# Altium schematic sheet Alimentation main board.SchDoc
size 508 x 193 mm
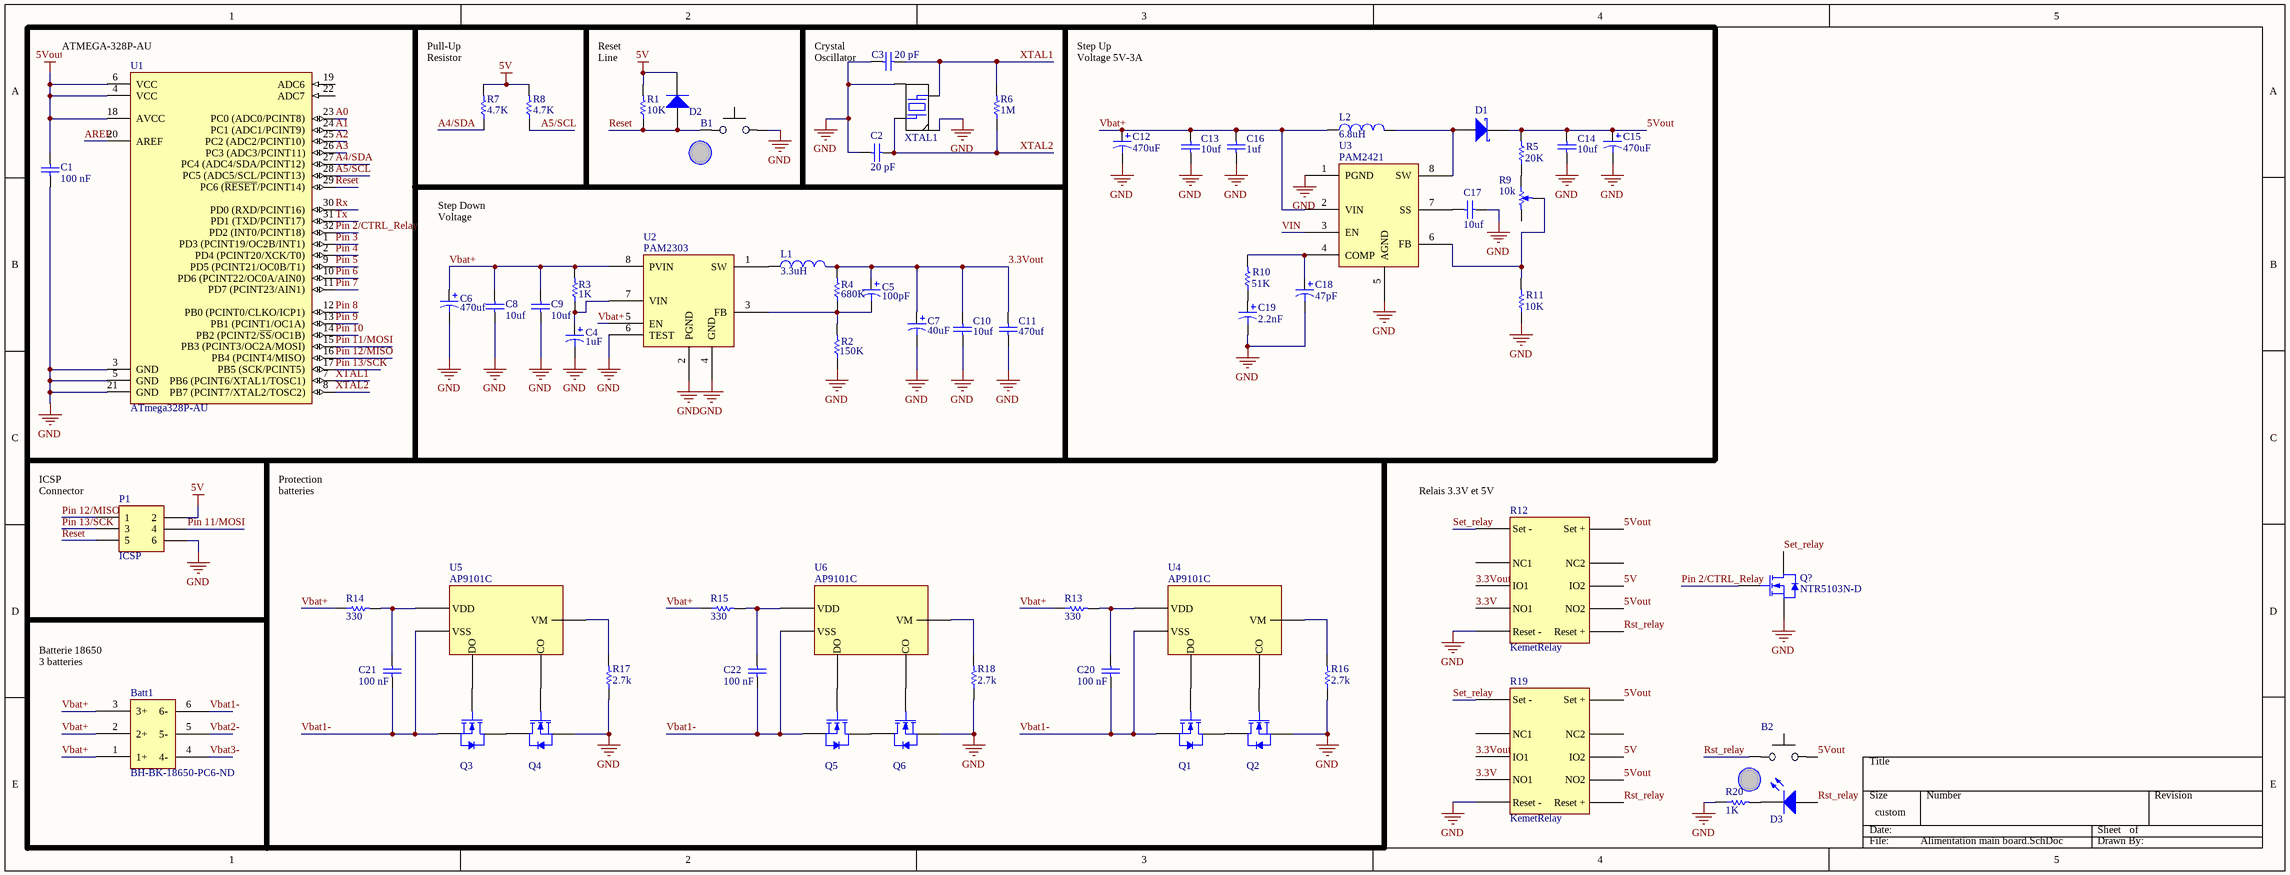
[diagram p0: Alimentation main board.SchDoc]

## Parts
B1  Button smd  [Button smd]  (value not drawn)
B2  Button smd  [Button smd]  (value not drawn)
Batt1  BH-BK-18650-PC6-ND  [BH-BK-18650-PC6-ND]
C1  100 nF  [CAP 0805 - N]
C2  20 pF  [CAP 0805 - N]
C3  20 pF  [CAP 0805 - N]
C4  value 1uF  [Capacitor 1 uF]  (hidden comment: Cap Pol1)
C5  value 100pF  [CAP 0805 - N]  (hidden comment: Cap Pol1)
C6  value 470uf  [Capacitor 40uF]  (hidden comment: Cap Pol1)
C7  value 40uF  [Capacitor 40uF]  (hidden comment: Cap Pol1)
C8  10uf  [CAP 0805 - N]
C9  10uf  [CAP 0805 - N]
C10  10uf  [CAP 0805 - N]
C11  470uf  [CAP 0805 - N]
C12  value 470uF  [Capacitor 470 uF]  (hidden comment: Cap Pol1)
C13  10uf  [CAP 0805 - N]
C14  10uf  [CAP 0805 - N]
C15  value 470uF  [Capacitor 470 uF]  (hidden comment: Cap Pol1)
C16  1uf  [CAP 0805 - N]
C17  10uf  [CAP 0805 - N]
C18  value 47pF  [CAP 0805 - N]  (hidden comment: Cap Pol1)
C19  value 2.2nF  [CAP 0805 - N]  (hidden comment: Cap Pol1)
C20  100 nF  [CAP 0805 - N]
C21  100 nF  [CAP 0805 - N]
C22  100 nF  [CAP 0805 - N]
D1  Diode SS34  [Diode]  (value not drawn)
D2  Diode 1N4148 SMD  [SOD-80]  (value not drawn)
D3  LED 1206  [LED - 1206]  (value not drawn)
L1  value 3.3uH  [Inductance]  (hidden comment: Inductor)
L2  value 6.8uH  [Inductance 6.8uH]  (hidden comment: Inductor)
P1  ICSP  [HDR2X3]
Q1  Mosfet 14A smd  [SON127P630X110-8N]  (value not drawn)
Q2  Mosfet 14A smd  [SON127P630X110-8N]  (value not drawn)
Q3  Mosfet 14A smd  [SON127P630X110-8N]  (value not drawn)
Q4  Mosfet 14A smd  [SON127P630X110-8N]  (value not drawn)
Q5  Mosfet 14A smd  [SON127P630X110-8N]  (value not drawn)
Q6  Mosfet 14A smd  [SON127P630X110-8N]  (value not drawn)
Q?  NTR5103N-D  [SOT-23-3-318-08_V]
R1  value 10K  [Res 0805 - N]  (hidden comment: Res smd)
R2  value 150K  [Res 0805 - N]  (hidden comment: Res1)
R3  value 1K  [Res 0805 - N]  (hidden comment: Res1)
R4  value 680K  [Res 0805 - N]  (hidden comment: Res1)
R5  value 20K  [Res 0805 - N]  (hidden comment: Res1)
R6  value 1M  [Res 0805 - N]  (hidden comment: Res smd)
R7  value 4.7K  [Res 0805 - N]  (hidden comment: Res smd)
R8  value 4.7K  [Res 0805 - N]  (hidden comment: Res smd)
R9  10k  [POT4MM-2]
R10  value 51K  [Res 0805 - N]  (hidden comment: Res1)
R11  value 10K  [Res 0805 - N]  (hidden comment: Res1)
R12  KemetRelay  [KemetRelay]
R13  value 330  [Res 0805 - N]  (hidden comment: Res smd)
R14  value 330  [Res 0805 - N]  (hidden comment: Res smd)
R15  value 330  [Res 0805 - N]  (hidden comment: Res smd)
R16  value 2.7k  [Res 0805 - N]  (hidden comment: Res smd)
R17  value 2.7k  [Res 0805 - N]  (hidden comment: Res smd)
R18  value 2.7k  [Res 0805 - N]  (hidden comment: Res smd)
R19  KemetRelay  [KemetRelay]
R20  value 1K  [Res 0805 - N]  (hidden comment: Res smd)
U1  ATmega328P-AU  [32A_N]
U2  Name: PAM2303  [SOP8]  (hidden comment: PAM2320)
U3  PAM2421  [SOP8]
U4  AP9101C  [SOT26]
U5  AP9101C  [SOT26]
U6  AP9101C  [SOT26]
XTAL1  Crystal oscillator 4 pin  [FA-238]  (value not drawn)

## Nets
5V: D2.2 P1.2 R1.2 R7.2 R8.2 R12.4(IO2) R19.4(IO2)
5Vout: B2.2 C1.2 C14.2 C15.1 D1.1(K) R5.2 R12.1(Set_+) R12.5(NO2) R19.1(Set_+) R19.5(NO2) U1.4(VCC) U1.6(VCC) U1.18(AVCC)
GND: B1.2 C1.1 C2.1 C3.1 C4.2 C6.2 C7.2 C8.1 C9.1 C10.1 C11.1 C12.2 C13.1 C14.1 C15.2 C16.1 C17.1 C18.2 C19.2 P1.6 Q2.S Q4.S Q6.S Q?.2(S) R2.1 R11.1 R12.7(Reset_-) R16.1 R17.1 R18.1 R19.7(Reset_-) R20.1 U1.3(GND) U1.5(GND) U1.21(GND) U2.2(PGND) U2.4(GND) U2.6(TEST) U3.1(PGND) U3.5(AGND) XTAL1.2 XTAL1.4
3.3V: R12.8(NO1) R19.8(NO1)
3.3Vout: C5.1 C7.1 C10.2 C11.2 L1.2 R4.2 R12.9(IO1) R19.9(IO1)
A0: U1.23(PC0_(ADC0/PCINT8))
A1: U1.24(PC1_(ADC1/PCINT9))
A2: U1.25(PC2_(ADC2/PCINT10))
A3: U1.26(PC3_(ADC3/PCINT11))
A4/SDA: R7.1 U1.27(PC4_(ADC4/SDA/PCINT12))
A5/SCL: R8.1 U1.28(PC5_(ADC5/SCL/PCINT13))
AREF: U1.20(AREF)
Pin 2/CTRL_Relay: Q?.1(G) U1.32(PD2_(INT0/PCINT18))
Pin 3: U1.1(PD3_(PCINT19/OC2B/INT1))
Pin 4: U1.2(PD4_(PCINT20/XCK/T0))
Pin 5: U1.9(PD5_(PCINT21/OC0B/T1))
Pin 6: U1.10(PD6_(PCINT22/OC0A/AIN0))
Pin 7: U1.11(PD7_(PCINT23/AIN1))
Pin 8: U1.12(PB0_(PCINT0/CLKO/ICP1))
Pin 9: U1.13(PB1_(PCINT1/OC1A))
Pin 10: U1.14(PB2_(PCINT2/~{SS}/OC1B))
Pin 11/MOSI: P1.4 U1.15(PB3_(PCINT3/OC2A/MOSI))
Pin 12/MISO: P1.1 U1.16(PB4_(PCINT4/MISO))
Pin 13/SCK: P1.3 U1.17(PB5_(SCK/PCINT5))
Reset: B1.1 D2.1 P1.5 R1.1 U1.29(PC6_(~{RESET}/PCINT14))
Rst_relay: B2.1 D3.1 R12.6(Reset_+) R19.6(Reset_+)
Rx: U1.30(PD0_(RXD/PCINT16))
Set_relay: Q?.3(D) R12.12(Set_-) R19.12(Set_-)
Tx: U1.31(PD1_(TXD/PCINT17))
Vbat1-: Batt1.6(6-) C20.1 C21.1 C22.1 Q1.S Q3.S Q5.S U4.VSS U5.VSS U6.VSS
Vbat2-: Batt1.5(5-)
Vbat3-: Batt1.4(4-)
Vbat+: Batt1.1(1+) Batt1.2(2+) Batt1.3(3+) C6.1 C8.2 C9.2 C12.1 C13.2 C16.2 L2.1 R3.2 R13.1 R14.1 R15.1 U2.5(EN) U2.8(PVIN) U3.2(VIN)
VIN: U3.3(EN)
XTAL1: C3.2 R6.2 U1.7(PB6_(PCINT6/XTAL1/TOSC1)) XTAL1.1
XTAL2: C2.2 R6.1 U1.8(PB7_(PCINT7/XTAL2/TOSC2)) XTAL1.3
NetC4_1: C4.1 R3.1 U2.7(VIN)
NetC5_2: C5.2 R2.2 R4.1 U2.3(FB)
NetC17_2: C17.2 U3.7(SS)
NetC18_1: C18.1 R10.2 U3.4(COMP)
NetC19_1: C19.1 R10.1
NetC20_2: C20.2 R13.2 U4.VDD
NetC21_2: C21.2 R14.2 U5.VDD
NetC22_2: C22.2 R15.2 U6.VDD
NetD1_3: D1.3(A) L2.2 U3.8(SW)
NetD3_2: D3.2 R20.2
NetL1_1: L1.1 U2.1(SW)
NetQ1_D: Q1.D Q2.D
NetQ1_G: Q1.G U4.DO
NetQ2_G: Q2.G U4.CO
NetQ3_D: Q3.D Q4.D
NetQ3_G: Q3.G U5.DO
NetQ4_G: Q4.G U5.CO
NetQ5_D: Q5.D Q6.D
NetQ5_G: Q5.G U6.DO
NetQ6_G: Q6.G U6.CO
NetR5_1: R5.1 R9.CW(+)
NetR9_W: R9.W R11.2 U3.6(FB)
NetR16_2: R16.2 U4.VM
NetR17_2: R17.2 U5.VM
NetR18_2: R18.2 U6.VM

Not connected (* = marked no-connect by the designer): R9 CCW(-); R12 3(NC2) 10(NC1); R19 3(NC2) 10(NC1); U1 19(ADC6) 22(ADC7)

## Notes on the sheet
- (near U1) ATMEGA-328P-AU
- Pull-Up
  Resistor
- Reset
  Line
- (near C3) Crystal
  Oscillator
- Step Up Voltage 5V-3A
- Step Down Voltage 3.3V-3A
- (near P1) ICSP
  Connector
- Protection batteries
- (near R12) Relais 3.3V et 5V
- Batterie 18650
  3 batteries parallèles

## Library data of the parts
C1-C3 C8-C11 C13 C14 C16 C17 C20-C22 = Condensateur smd: Value: 5 pF
C4-C7 C12 C15 C18 C19 = Cap Pol1: Polarized Capacitor (Radial); Published: 8-Jun-2000; LatestRevisionDate: 17-Jul-2002; LatestRevisionNote: Re-released for DXP Platform.; PackageReference: RB7.6-15; Publisher: Altium Limited; PackageDescription: Polarized Capacitor (Radial); 2 Leads
D1 = Diode 10TQ035: Schottky Rectifier; Note: Terminal 2 is the TAB and is electrically connected to the cathode; Published: 8-Jun-2000; LatestRevisionDate: 17-Jul-2002; LatestRevisionNote: Re-released for DXP Platform.; DatasheetVersion: PD-2.057B; PackageVersion: Feb-1998; PackageReference: TO-220AC; Publisher: Altium Limited; PackageDescription: TO, Thru-Hole, Vertical, Heatsink Mounted; 3 In-Line Leads (1 Absent); Pitch 2.54 mm; ComponentLink1Description: Manufacturer Link; ComponentLink1URL: http://www.irf.com/; ComponentLink2Description: Datasheet; ComponentLink2URL: http://www.irf.com/product-info/datasheets/data/10tq.pdf
D2 = Diode 1N4148
D3 = LED: Color: Green
L1 L2 = Inductor: Code_IEC: 1005; Published: 8-Jun-2000; LatestRevisionDate: 29-May-2009; LatestRevisionNote: IPC-7351 Footprint Added.; PackageReference: 0402-A; Publisher: Altium Limited; PackageDescription: Chip Inductor; Code_JEITA: 0402
P1 = Header 3X2: Header, 3-Pin, Dual row; LatestRevisionDate: 17-Jul-2002; LatestRevisionNote: Re-released for DXP Platform.; Publisher: Altium Limited
Q1-Q6 = CSD16412Q5A: Mosfet 14A
Q? = NTR5198NLT1G: Power MOSFET, 60 V, 155 mOhm, Single N-Channel Logic Level, 3-Pin SOT-23, Pb-Free, Tape and Reel; Manufacturer: On Semiconductor; Channel Polarity: N Channel; Ciss Typ (pF): 182; Coss Typ (pF): 25; Crss Typ (pF): 16; ID Max (A): 2.2; Qrr Typ (nC): 6; V(BR)DSS Min (V): 60; VGS Max (V): 20; VGS(th) Max (V): 2.5; DatasheetVersion: Rev. 0; PackageVersion: Rev. AP, 11/2009; PackageReference: SOT-23-3-318-08; PackageDescription: 3-Pin Small Outline Transistor, Body 2.92 x 1.3 mm, Pitch 0.95 mm; Supplier 1: Digi-Key; Supplier Part Number 1: NTR5198NLT1GOSTR-ND; Supplier 2: Digi-Key; Supplier Part Number 2: NTR5198NLT1GOSCT-ND; Supplier 3: Digi-Key; Supplier Part Number 3: NTR5198NLT1GOSDKR-ND; Supplier 4: Newark; Supplier Part Number 4: 11X3689; Supplier 5: Mouser; Supplier Part Number 5: 863-NTR5198NLT1G; Configuration: Single; Package Type: SOT-23-3; Packing: Tape and Reel; RoHS: Pb-Free; Mounting Technology: Surface Mount; PartNumber: NTR5198NLT1G; ComponentLink1Description: Manufacturer URL; ComponentLink1URL: http://www.onsemi.com/; ComponentLink2Description: Datasheet; ComponentLink2URL: http://www.onsemi.com/pub_link/Collateral/NTR5198NL-D.PDF; ComponentLink3Description: Package Specification; ComponentLink3URL: http://www.onsemi.cn/pub_link/Collateral/318-08.PDF
R2-R5 R10 R11 = Res1: Resistor; Published: 8-Jun-2000; LatestRevisionDate: 17-Jul-2002; LatestRevisionNote: Re-released for DXP Platform.; PackageReference: AXIAL-0.3; Publisher: Altium Limited; PackageDescription: Axial Device, Thru-Hole; 2 Leads; 0.3 in Pin Spacing
R9 = RPot SM: Square Trimming Potentiometer; Published: 17-Dec-2003; DatasheetVersion: Oct-2003; PackageReference: POT4MM-2; Publisher: Altium Limited; PackageDescription: Square Trimming Potentiometer; ComponentLink1Description: Manufacturer Link; ComponentLink1URL: http://bourns.com/2/search.html
U1 = ATmega328P-AU: 8-bit AVR Microcontroller, 32KB Flash, 1KB EEPROM, 2KB SRAM, 32-pin TQFP, Industrial Grade (-40°C to 85°C); Published: 1-Apr-2010; DatasheetVersion: revA, Jan-2010; PackageVersion: revB, Oct-2001; PackageReference: 32A; Publisher: Altium Limited; PackageDescription: 32-Lead, 7x7x1.0 mm Body, 0.8mm Lead Pitch, Thin Profile Plastic Quad Flat Package (TQFP); Supplier 1: Digi-Key; Supplier Part Number 1: ATMEGA328P-AU-ND; Supplier 2: Farnell; Supplier Part Number 2: 1715486; Supplier 3: Mouser; Supplier Part Number 3: 556-ATMEGA328P-AU; Code_JEDEC: MS-026-ABA; ComponentLink1Description: Manufacturer Link; ComponentLink1URL: http://www.atmel.com/products/avr/default.asp?; ComponentLink2Description: ATmega48A/48PA/88A/88PA/168A/168PA/328/328P Datasheet; ComponentLink2URL: http://www.atmel.com/dyn/resources/prod_documents/8271.pdf; ComponentLink3Description: ATmega48A/48PA/88A/88PA/168A/168PA/328/328P Summary; ComponentLink3URL: http://www.atmel.com/dyn/resources/prod_documents/8271S.pdf; ComponentLink4Description: Atmel.com Home; ComponentLink4URL: http://www.atmel.com
U2 = PAM2320: 3A LOW NOISE STEP-DOWN DC-DC CONVERTER
U3 = PAM2421: 3A PWM STEP-UP DC-DC CONVERTER
U4-U6 = AP9101C: pin to pad: CO>3 DO>1 VDD>5 VM>2 VSS>6; NAME: AP9101C
XTAL1 = Crystal 4 pin: Value: 16 MHz